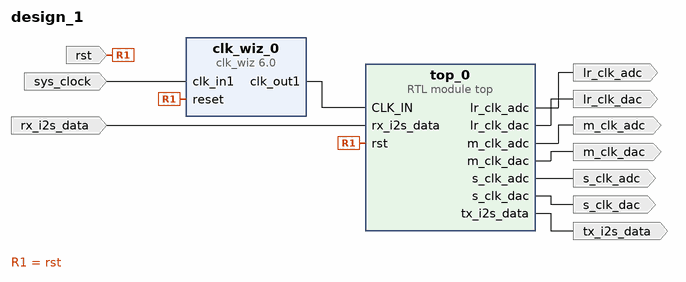
[diagram p0: block diagram of the top level]
# Vivado block design design_1, xc7z020clg400-1, Vivado 2023.2
create_bd_design design_1

create_bd_port -dir I rx_i2s_data
create_bd_port -dir O lr_clk_adc
create_bd_port -dir O m_clk_dac
create_bd_port -dir O m_clk_adc
create_bd_port -dir O s_clk_dac
create_bd_port -dir O s_clk_adc
create_bd_port -dir O tx_i2s_data
create_bd_port -dir O lr_clk_dac
create_bd_port -dir I -type rst rst
set_property -dict {CONFIG.POLARITY ACTIVE_HIGH} [get_bd_ports rst]
create_bd_port -dir I -type clk sys_clock
set_property -dict {CONFIG.FREQ_HZ 125000000 CONFIG.PHASE 0.0} [get_bd_ports sys_clock]

create_bd_cell -type module -reference top top_0
set_property -dict {CONFIG.MCLK_DIVISION 4} [get_bd_cells top_0]
create_bd_cell -type ip -vlnv xilinx.com:ip:clk_wiz:6.0 clk_wiz_0
set_property -dict [list \
  CONFIG.CLKOUT1_DRIVES BUFG \
  CONFIG.CLKOUT1_JITTER 237.312 \
  CONFIG.CLKOUT1_PHASE_ERROR 249.865 \
  CONFIG.CLKOUT2_DRIVES BUFG \
  CONFIG.CLKOUT3_DRIVES BUFG \
  CONFIG.CLKOUT4_DRIVES BUFG \
  CONFIG.CLKOUT5_DRIVES BUFG \
  CONFIG.CLKOUT6_DRIVES BUFG \
  CONFIG.CLKOUT7_DRIVES BUFG \
  CONFIG.CLK_IN1_BOARD_INTERFACE sys_clock \
  CONFIG.ENABLE_CLOCK_MONITOR false \
  CONFIG.FEEDBACK_SOURCE FDBK_AUTO \
  CONFIG.MMCM_BANDWIDTH OPTIMIZED \
  CONFIG.MMCM_CLKFBOUT_MULT_F 36 \
  CONFIG.MMCM_CLKIN2_PERIOD 10.0 \
  CONFIG.MMCM_CLKOUT0_DIVIDE_F 9 \
  CONFIG.MMCM_COMPENSATION ZHOLD \
  CONFIG.MMCM_DIVCLK_DIVIDE 5 \
  CONFIG.PRIMITIVE PLL \
  CONFIG.RESET_PORT reset \
  CONFIG.RESET_TYPE ACTIVE_HIGH \
  CONFIG.SECONDARY_SOURCE Single_ended_clock_capable_pin \
  CONFIG.USE_BOARD_FLOW true \
  CONFIG.USE_FREQ_SYNTH true \
  CONFIG.USE_PHASE_ALIGNMENT true \
] [get_bd_cells clk_wiz_0]

# ---- connections ----

connect_bd_net [get_bd_pins clk_wiz_0/clk_out1] [get_bd_pins top_0/CLK_IN]
connect_bd_net -net reset_rtl_1 [get_bd_ports rst] [get_bd_pins top_0/rst] [get_bd_pins clk_wiz_0/reset]
connect_bd_net -net rx_i2s_data_0_1 [get_bd_ports rx_i2s_data] [get_bd_pins top_0/rx_i2s_data]
connect_bd_net [get_bd_ports sys_clock] [get_bd_pins clk_wiz_0/clk_in1]
connect_bd_net [get_bd_pins top_0/lr_clk_adc] [get_bd_ports lr_clk_adc]
connect_bd_net [get_bd_pins top_0/lr_clk_dac] [get_bd_ports lr_clk_dac]
connect_bd_net [get_bd_pins top_0/m_clk_adc] [get_bd_ports m_clk_adc]
connect_bd_net [get_bd_pins top_0/m_clk_dac] [get_bd_ports m_clk_dac]
connect_bd_net [get_bd_pins top_0/s_clk_adc] [get_bd_ports s_clk_adc]
connect_bd_net [get_bd_pins top_0/s_clk_dac] [get_bd_ports s_clk_dac]
connect_bd_net [get_bd_pins top_0/tx_i2s_data] [get_bd_ports tx_i2s_data]

validate_bd_design
save_bd_design
